# Altium schematic sheet cover.SchDoc: Cover
size A4; Organization: GPA Robotics; DocumentNumber: 1; SheetNumber: 1; SheetTotal: 11
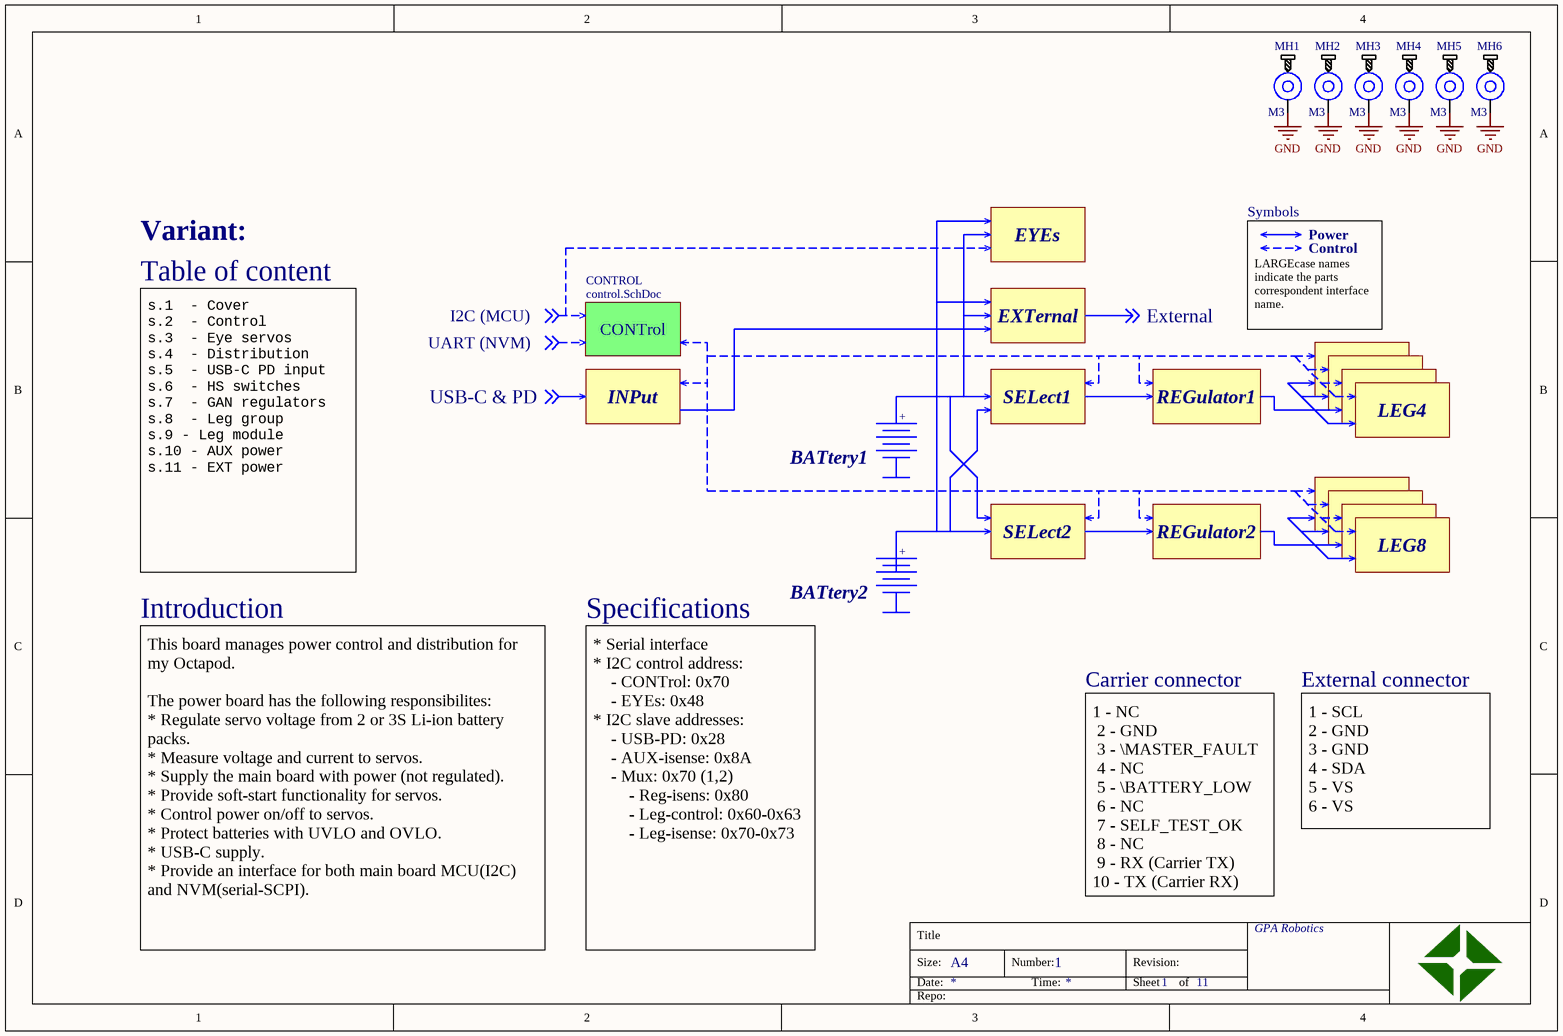
[diagram p0: cover.SchDoc]

## Parts
MH1  M3  [mount_m3_normal]
MH2  M3  [mount_m3_normal]
MH3  M3  [mount_m3_normal]
MH4  M3  [mount_m3_normal]
MH5  M3  [mount_m3_normal]
MH6  M3  [mount_m3_normal]

## Sub-sheets
CONTROL = control.SchDoc: no entries

## Nets
GND: MH1.1 MH2.1 MH3.1 MH4.1 MH5.1 MH6.1

## Notes on the sheet
- EYEs
- Symbols
- Power
- Control
- Table of content
- I2C (MCU)
- EXTernal
- External
- UART (NVM)
- CONTrol
- LARGEcase names indicate the parts correspondent interface name.
- USB-C & PD
- INPut
- +
- SELect1
- REGulator1
- LEG4
- BATtery1
- s.1  - Cover
  s.2  - Control
  s.3  - Eye servos
  s.4  - Distribution
  s.5  - USB-C PD input
  s.6  - HS switches
  s.7  - GAN regulators
  s.8  - Leg group
  s.9 - Leg module
  s.10 - AUX power
  s.11 - EXT power
- SELect2
- REGulator2
- LEG8
- Introduction
- Specifications
- BATtery2
- Carrier connector
- External connector
- 1 - SCL
  2 - GND
  3 - GND
  4 - SDA
  5 - VS
  6 - VS
- 1 - NC
  2 - GND
  3 - \MASTER_FAULT
  4 - NC
  5 - \BATTERY_LOW
  6 - NC
  7 - SELF_TEST_OK
  8 - NC
  9 - RX (Carrier TX)
  10 - TX (Carrier RX)
- This board manages power control and distribution for my Octapod.
  The power board has the following responsibilites:
  * Regulate servo voltage from 2 or 3S Li-ion battery packs.
  * Measure voltage and current to servos.
  * Supply the main board with power (not regulated).
  * Provide soft-start functionality for servos.
  * Control power on/off to servos.
  * Protect batteries with UVLO and OVLO.
  * USB-C supply.
  * Provide an interface for both main board MCU(I2C) and NVM(serial-SCPI).
- * Serial interface
  * I2C control address:
  - CONTrol: 0x70
  - EYEs: 0x48
  * I2C slave addresses:
  - USB-PD: 0x28
  - AUX-isense: 0x8A
  - Mux: 0x70 (1,2)
  - Reg-isens: 0x80
  - Leg-control: 0x60-0x63
  - Leg-isense: 0x70-0x73
- Variant:
- Title
- Size:
- Date:
- A4
- Number:
- Time:
- Revision:
- Sheet
- of
- Repo:

## Library data of the parts
MH1-MH6 = mounting_hole: Mounting hole